# Altium schematic sheet top.SchDoc: myA4
size A4; Date: 2018/03/26; DrawnBy: 亓岳鑫; Organization: Altium Limited; Address1: 3 Minna Close; Address2: Belrose; Address3: NSW 2085; Address4: Australia; DocumentNumber: 1; Revision: Alfa 2.0; SheetNumber: 1; SheetTotal: 6; Time: 17:30
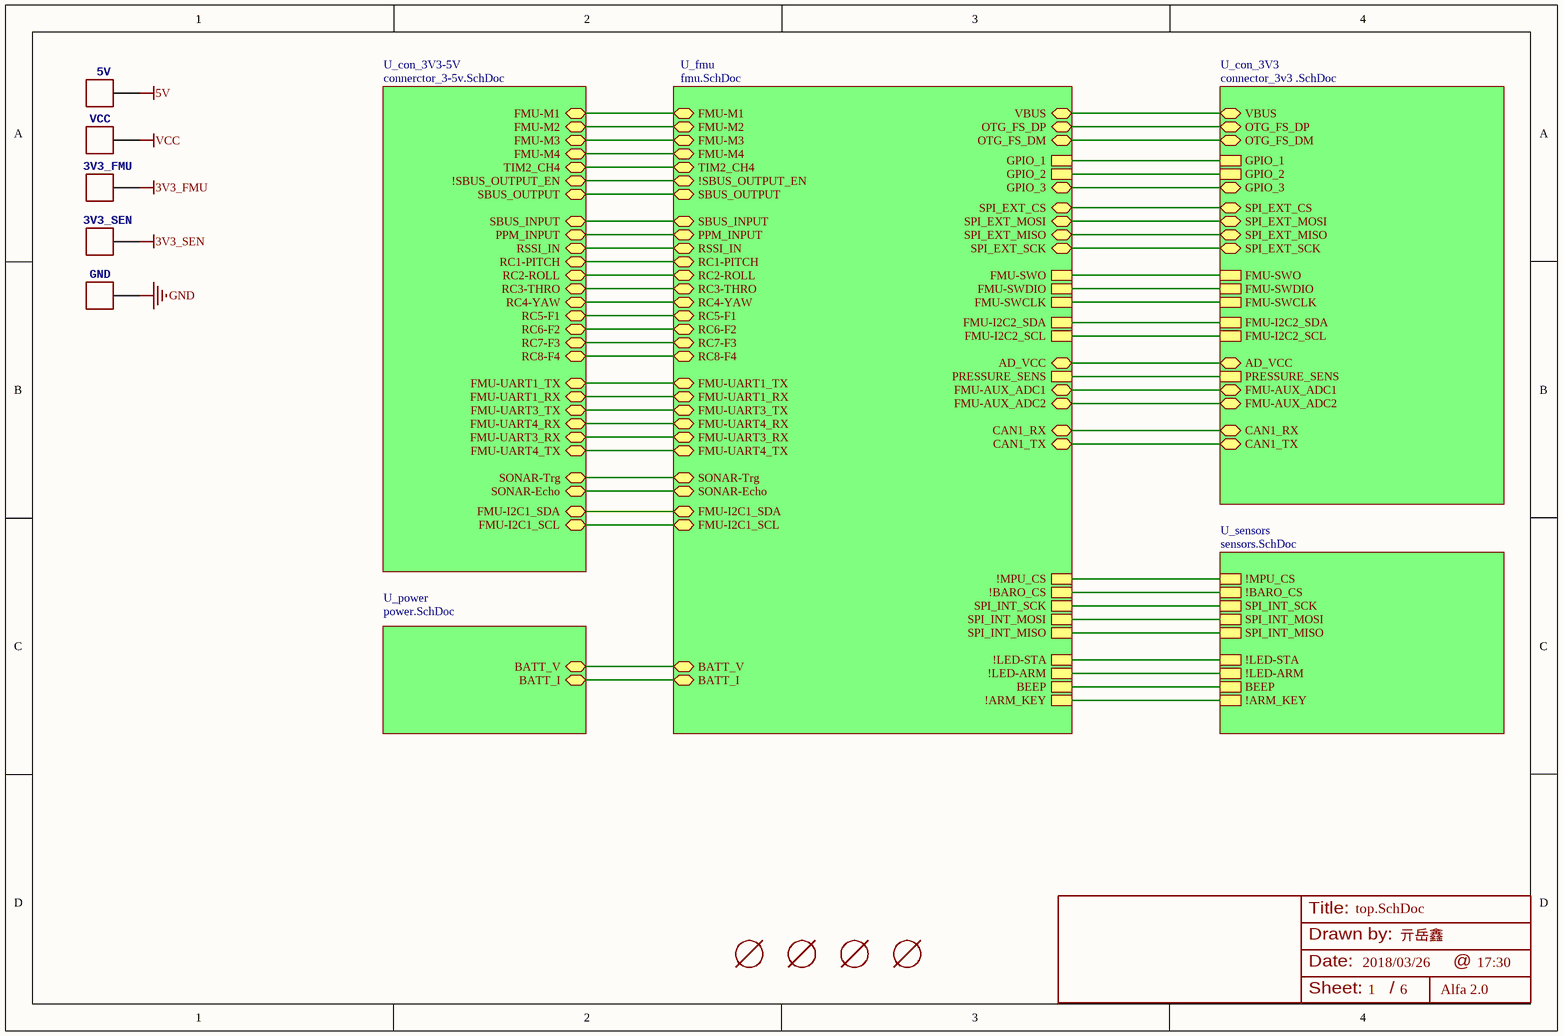
[diagram p0: top.SchDoc]

## Parts
3V3_FMU  TEST  [PAD.04X.04]  (value not drawn)
3V3_SEN  TEST  [PAD.04X.04]  (value not drawn)
5V  TEST  [PAD.04X.04]  (value not drawn)
GND  TEST  [PAD.04X.04]  (value not drawn)
M101  MOUNT-HOLE3MM  [HOLE-3mm]  (value not drawn)
M102  MOUNT-HOLE3MM  [HOLE-3mm]  (value not drawn)
M103  MOUNT-HOLE3MM  [HOLE-3mm]  (value not drawn)
M104  MOUNT-HOLE3MM  [HOLE-3mm]  (value not drawn)
VCC  TEST  [PAD.04X.04]  (value not drawn)

## Sub-sheets
U_con_3V3 = connector_3v3 .SchDoc: FMU-SWCLK, FMU-SWDIO, FMU-SWO, GPIO_1, OTG_FS_DP, OTG_FS_DM, GPIO_2, VBUS, SPI_EXT_MOSI, SPI_EXT_MISO, SPI_EXT_SCK, CAN1_RX, CAN1_TX, SPI_EXT_CS, PRESSURE_SENS, FMU-I2C2_SDA, FMU-I2C2_SCL, FMU-AUX_ADC1, FMU-AUX_ADC2, AD_VCC, GPIO_3
U_con_3V3-5V = connerctor_3-5v.SchDoc: FMU-M1, FMU-M2, FMU-M3, FMU-M4, PPM_INPUT, SBUS_INPUT, SBUS_OUTPUT, !SBUS_OUTPUT_EN, RSSI_IN, FMU-UART1_TX, FMU-UART1_RX, FMU-UART3_TX, FMU-UART4_RX, FMU-UART3_RX, FMU-UART4_TX, RC5-F1, RC3-THRO, RC1-PITCH, RC4-YAW, RC2-ROLL, RC6-F2, RC7-F3, RC8-F4, SONAR-Echo, TIM2_CH4, FMU-I2C1_SDA, FMU-I2C1_SCL, SONAR-Trg
U_fmu = fmu.SchDoc: BATT_I, BATT_V, FMU-M1, FMU-M2, FMU-M3, FMU-M4, PPM_INPUT, SBUS_INPUT, SBUS_OUTPUT, !SBUS_OUTPUT_EN, RSSI_IN, FMU-UART1_TX, FMU-UART1_RX, FMU-UART3_TX, FMU-UART4_RX, FMU-UART3_RX, FMU-UART4_TX, RC5-F1, RC3-THRO, RC1-PITCH, RC4-YAW, RC2-ROLL, RC6-F2, RC7-F3, RC8-F4, SONAR-Echo, TIM2_CH4, FMU-I2C1_SDA, FMU-I2C1_SCL, SONAR-Trg, FMU-SWCLK, FMU-SWDIO, FMU-SWO, GPIO_1, OTG_FS_DP, OTG_FS_DM, GPIO_2, VBUS, SPI_EXT_MOSI, SPI_EXT_MISO, SPI_EXT_SCK, CAN1_RX, CAN1_TX, SPI_EXT_CS, PRESSURE_SENS, FMU-I2C2_SDA, FMU-I2C2_SCL, FMU-AUX_ADC1, FMU-AUX_ADC2, AD_VCC, GPIO_3, !MPU_CS, !BARO_CS, SPI_INT_SCK, SPI_INT_MOSI, SPI_INT_MISO, !LED-STA, !LED-ARM, !ARM_KEY, BEEP
U_power = power.SchDoc: BATT_I, BATT_V
U_sensors = sensors.SchDoc: !MPU_CS, !BARO_CS, SPI_INT_SCK, SPI_INT_MOSI, SPI_INT_MISO, !LED-STA, !LED-ARM, !ARM_KEY, BEEP

## Nets
3V3_FMU: 3V3_FMU.P$1
3V3_SEN: 3V3_SEN.P$1
5V: 5V.P$1
GND: GND.P$1
VCC: VCC.P$1
(unnamed): sheet U_fmu/BATT_I, sheet U_power/BATT_I
(unnamed): sheet U_fmu/BATT_V, sheet U_power/BATT_V
(unnamed): sheet U_fmu/FMU-M1, sheet U_con_3V3-5V/FMU-M1
(unnamed): sheet U_fmu/FMU-M2, sheet U_con_3V3-5V/FMU-M2
(unnamed): sheet U_fmu/FMU-M3, sheet U_con_3V3-5V/FMU-M3
(unnamed): sheet U_fmu/FMU-M4, sheet U_con_3V3-5V/FMU-M4
(unnamed): sheet U_fmu/PPM_INPUT, sheet U_con_3V3-5V/PPM_INPUT
(unnamed): sheet U_fmu/SBUS_INPUT, sheet U_con_3V3-5V/SBUS_INPUT
(unnamed): sheet U_fmu/SBUS_OUTPUT, sheet U_con_3V3-5V/SBUS_OUTPUT
(unnamed): sheet U_fmu/!SBUS_OUTPUT_EN, sheet U_con_3V3-5V/!SBUS_OUTPUT_EN
(unnamed): sheet U_fmu/RSSI_IN, sheet U_con_3V3-5V/RSSI_IN
(unnamed): sheet U_fmu/FMU-UART1_TX, sheet U_con_3V3-5V/FMU-UART1_TX
(unnamed): sheet U_fmu/FMU-UART1_RX, sheet U_con_3V3-5V/FMU-UART1_RX
(unnamed): sheet U_fmu/FMU-UART3_TX, sheet U_con_3V3-5V/FMU-UART3_TX
(unnamed): sheet U_fmu/FMU-UART4_RX, sheet U_con_3V3-5V/FMU-UART4_RX
(unnamed): sheet U_fmu/FMU-UART3_RX, sheet U_con_3V3-5V/FMU-UART3_RX
(unnamed): sheet U_fmu/FMU-UART4_TX, sheet U_con_3V3-5V/FMU-UART4_TX
(unnamed): sheet U_fmu/RC5-F1, sheet U_con_3V3-5V/RC5-F1
(unnamed): sheet U_fmu/RC3-THRO, sheet U_con_3V3-5V/RC3-THRO
(unnamed): sheet U_fmu/RC1-PITCH, sheet U_con_3V3-5V/RC1-PITCH
(unnamed): sheet U_fmu/RC4-YAW, sheet U_con_3V3-5V/RC4-YAW
(unnamed): sheet U_fmu/RC2-ROLL, sheet U_con_3V3-5V/RC2-ROLL
(unnamed): sheet U_fmu/RC6-F2, sheet U_con_3V3-5V/RC6-F2
(unnamed): sheet U_fmu/RC7-F3, sheet U_con_3V3-5V/RC7-F3
(unnamed): sheet U_fmu/RC8-F4, sheet U_con_3V3-5V/RC8-F4
(unnamed): sheet U_fmu/SONAR-Echo, sheet U_con_3V3-5V/SONAR-Echo
(unnamed): sheet U_fmu/TIM2_CH4, sheet U_con_3V3-5V/TIM2_CH4
(unnamed): sheet U_fmu/FMU-I2C1_SDA, sheet U_con_3V3-5V/FMU-I2C1_SDA
(unnamed): sheet U_fmu/FMU-I2C1_SCL, sheet U_con_3V3-5V/FMU-I2C1_SCL
(unnamed): sheet U_fmu/SONAR-Trg, sheet U_con_3V3-5V/SONAR-Trg
(unnamed): sheet U_fmu/FMU-SWCLK, sheet U_con_3V3/FMU-SWCLK
(unnamed): sheet U_fmu/FMU-SWDIO, sheet U_con_3V3/FMU-SWDIO
(unnamed): sheet U_fmu/FMU-SWO, sheet U_con_3V3/FMU-SWO
(unnamed): sheet U_fmu/GPIO_1, sheet U_con_3V3/GPIO_1
(unnamed): sheet U_fmu/OTG_FS_DP, sheet U_con_3V3/OTG_FS_DP
(unnamed): sheet U_fmu/OTG_FS_DM, sheet U_con_3V3/OTG_FS_DM
(unnamed): sheet U_fmu/GPIO_2, sheet U_con_3V3/GPIO_2
(unnamed): sheet U_fmu/VBUS, sheet U_con_3V3/VBUS
(unnamed): sheet U_fmu/SPI_EXT_MOSI, sheet U_con_3V3/SPI_EXT_MOSI
(unnamed): sheet U_fmu/SPI_EXT_MISO, sheet U_con_3V3/SPI_EXT_MISO
(unnamed): sheet U_fmu/SPI_EXT_SCK, sheet U_con_3V3/SPI_EXT_SCK
(unnamed): sheet U_fmu/CAN1_RX, sheet U_con_3V3/CAN1_RX
(unnamed): sheet U_fmu/CAN1_TX, sheet U_con_3V3/CAN1_TX
(unnamed): sheet U_fmu/SPI_EXT_CS, sheet U_con_3V3/SPI_EXT_CS
(unnamed): sheet U_fmu/PRESSURE_SENS, sheet U_con_3V3/PRESSURE_SENS
(unnamed): sheet U_fmu/FMU-I2C2_SDA, sheet U_con_3V3/FMU-I2C2_SDA
(unnamed): sheet U_fmu/FMU-I2C2_SCL, sheet U_con_3V3/FMU-I2C2_SCL
(unnamed): sheet U_fmu/FMU-AUX_ADC1, sheet U_con_3V3/FMU-AUX_ADC1
(unnamed): sheet U_fmu/FMU-AUX_ADC2, sheet U_con_3V3/FMU-AUX_ADC2
(unnamed): sheet U_fmu/AD_VCC, sheet U_con_3V3/AD_VCC
(unnamed): sheet U_fmu/GPIO_3, sheet U_con_3V3/GPIO_3
(unnamed): sheet U_fmu/!MPU_CS, sheet U_sensors/!MPU_CS
(unnamed): sheet U_fmu/!BARO_CS, sheet U_sensors/!BARO_CS
(unnamed): sheet U_fmu/SPI_INT_SCK, sheet U_sensors/SPI_INT_SCK
(unnamed): sheet U_fmu/SPI_INT_MOSI, sheet U_sensors/SPI_INT_MOSI
(unnamed): sheet U_fmu/SPI_INT_MISO, sheet U_sensors/SPI_INT_MISO
(unnamed): sheet U_fmu/!LED-STA, sheet U_sensors/!LED-STA
(unnamed): sheet U_fmu/!LED-ARM, sheet U_sensors/!LED-ARM
(unnamed): sheet U_fmu/!ARM_KEY, sheet U_sensors/!ARM_KEY
(unnamed): sheet U_fmu/BEEP, sheet U_sensors/BEEP

## Notes on the sheet
- Title:
- Drawn by:
- Date:
- @
- Sheet:
- /

## Library data of the parts
3V3_FMU 3V3_SEN 5V GND VCC = TEST: BOM: EXCLUDE; PARTNO: *
M101-M104 = MOUNT-HOLE3MM: BOM: EXCLUDE; PARTNO: *